# Altium schematic sheet schema.SchDoc
size A4
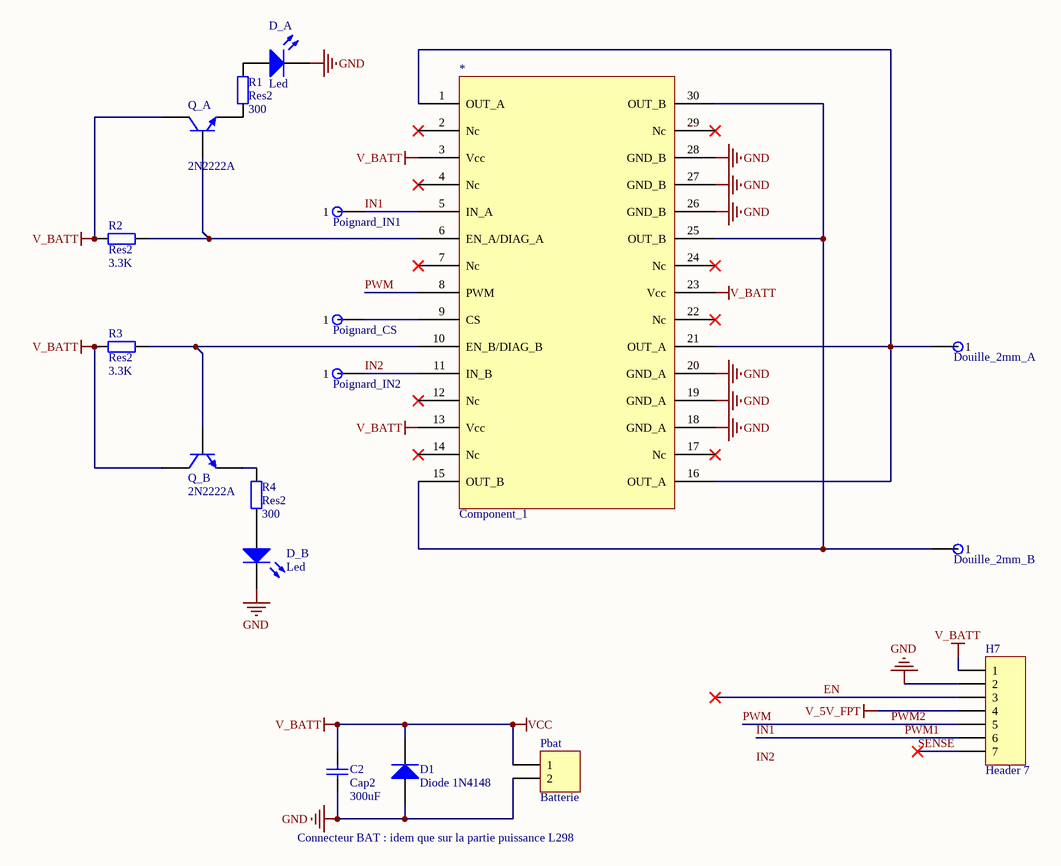
[diagram p0: schema.SchDoc]

## Parts
*  Component_1  [MultiPowerSO-30]
C2  Cap2  value 300uF  [CAPA2]
D1  Diode 1N4148  [Ddiode]
D_A  Led  [LED]
D_B  Led  [LED]
Douille_2mm_A  douille_2mm  [Douille-2mm]  (value not drawn)
Douille_2mm_B  douille_2mm  [Douille-2mm]  (value not drawn)
H7  Header 7  [HDR1X7]
Pbat  Batterie  [Bornier_2]
Poignard_CS  Poignard  [Poignard]  (value not drawn)
Poignard_IN1  Poignard  [Poignard]  (value not drawn)
Poignard_IN2  Poignard  [Poignard]  (value not drawn)
Q_A  2N2222A  [TO-18]
Q_B  2N2222A  [TO-18]
R1  Res2  value 300  [res5_1/4W]
R2  Res2  value 3.3K  [res5_1/4W]
R3  Res2  value 3.3K  [res5_1/4W]
R4  Res2  value 300  [res5_1/4W]

## Nets
GND: *.18(GND_A) *.19(GND_A) *.20(GND_A) *.26(GND_B) *.27(GND_B) *.28(GND_B) C2.1 D1.1(A) D_A.2(K) D_B.2(K) H7.2 Pbat.2
V_5V_FPT: H7.4
V_BATT: *.3(Vcc) *.13(Vcc) *.23(Vcc) C2.2 D1.2(K) H7.1 Pbat.1 Q_A.2(C) Q_B.2(C) R2.1 R3.1  [also labelled VCC]
EN: H7.3
IN1: *.5(IN_A) H7.6 Poignard_IN1.1  [also labelled PWM1]
IN2: *.11(IN_B) Poignard_IN2.1
PWM: *.8(PWM) H7.5  [also labelled PWM2]
SENSE: H7.7
Net*_1: *.1(OUT_A) *.16(OUT_A) *.21(OUT_A) Douille_2mm_A.1
Net*_6: *.6(EN_A/DIAG_A) Q_A.1(B) R2.2
Net*_9: *.9(CS) Poignard_CS.1
Net*_10: *.10(EN_B/DIAG_B) Q_B.1(B) R3.2
Net*_15: *.15(OUT_B) *.25(OUT_B) *.30(OUT_B) Douille_2mm_B.1
NetD_A_1: D_A.1(A) R1.2
NetD_B_1: D_B.1(A) R4.2
NetQ_A_3: Q_A.3(E) R1.1
NetQ_B_3: Q_B.3(E) R4.1

Not connected (* = marked no-connect by the designer): * 2(Nc)* 4(Nc)* 7(Nc)* 12(Nc)* 14(Nc)* 17(Nc)* 22(Nc)* 24(Nc)* 29(Nc)*

## Notes on the sheet
- Connecteur BAT : idem que sur la partie puissance L298
- Labels drawn without touching a wire or pin: IN2

## Library data of the parts
C2 = Cap2: Capacitor; Published: 8-Jun-2000; LatestRevisionDate: 17-Jul-2002; LatestRevisionNote: Re-released for DXP Platform.; PackageReference: RAD-0.3; Publisher: Altium Limited
D1 = Diode 1N4148: High Conductance Fast Diode; pin to pad: 1>A 2>K; Published: 8-Jun-2000; LatestRevisionDate: 17-Jul-2002; LatestRevisionNote: Re-released for DXP Platform.; DatasheetDocument: 1997; PackageReference: DO-35; Publisher: Altium Limited; Code_JEDEC: DO-204-AH; ComponentLink1Description: Manufacturer Link; ComponentLink1URL: http://www.fairchildsemi.com/; ComponentLink2Description: Datasheet; ComponentLink2URL: http://www.fairchildsemi.com/ds/1N%2F1N4148.pdf
Douille_2mm_A Douille_2mm_B = douille_2mm: 1-Pin; LatestRevisionDate: 17-Jul-2002; LatestRevisionNote: Re-released for DXP Platform.; Publisher: Altium Limited
H7 = Header 7: Header, 7-Pin; LatestRevisionDate: 17-Jul-2002; LatestRevisionNote: Re-released for DXP Platform.; Publisher: Altium Limited
Pbat = Bornier_2: Header, 2-Pin; LatestRevisionDate: 17-Jul-2002; LatestRevisionNote: Re-released for DXP Platform.; Publisher: Altium Limited
Q_A Q_B = 2N2222A: High Speed Switches; Published: 8-Jun-2000; LatestRevisionDate: 11-Dec-2002; LatestRevisionNote: Sim Port Map correction; DatasheetVersion: Jun-1999; PackageReference: TO-18; Publisher: Altium Limited; PackageDescription: Can; 3 Leads; Pin Circle Dia. 2.54 mm; Lead Dia. 0.49 mm (max); ComponentLink1Description: Manufacturer Link; ComponentLink1URL: http://www.st.com/; ComponentLink2Description: Datasheet; ComponentLink2URL: http://www.st.com/stonline/products/literature/ds/9288/2n2219a.pdf
R1-R4 = Res2: Resistor; Published: 8-Jun-2000; LatestRevisionDate: 17-Jul-2002; LatestRevisionNote: Re-released for DXP Platform.; PackageReference: AXIAL-0.4; Publisher: Altium Limited
D_A D_B = Led: Published: 8-Jun-2000; LatestRevisionDate: 17-Jul-2002; LatestRevisionNote: Re-released for DXP Platform.; DatasheetDocument: 1998; PackageDocument: Aug-1999; PackageReference: DO-41; Publisher: Altium Limited; Code_JEDEC: DO-204-AL; ComponentLink1Description: Manufacturer Link; ComponentLink1URL: http://www.fairchildsemi.com/; ComponentLink2Description: Datasheet; ComponentLink2URL: http://www.fairchildsemi.com/ds/1N%2F1N4001.pdf
Poignard_CS Poignard_IN1 Poignard_IN2 = Poignard: LatestRevisionDate: 17-Jul-2002; LatestRevisionNote: Re-released for DXP Platform.; Publisher: Altium Limited